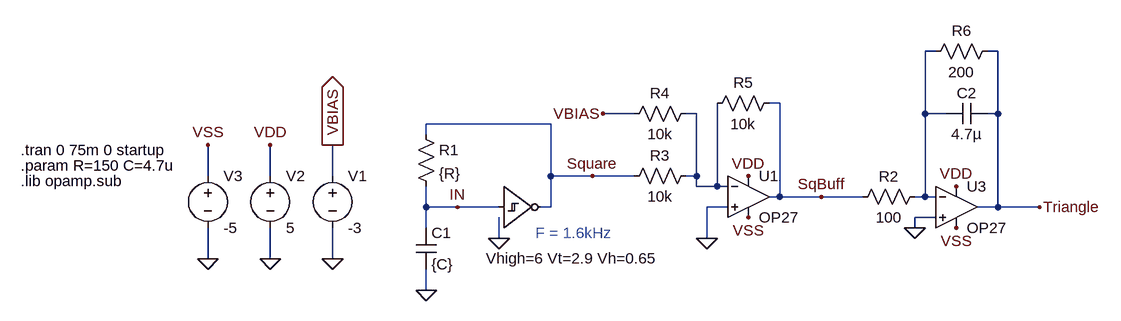
[diagram p0: schematic Schmitt_And_Integrator.asc]
Schmitt_And_Integrator.asc, the LTspice schematic file:
Version 4
SHEET 1 880 680
WIRE 480 -656 464 -656
WIRE 576 -656 560 -656
WIRE 240 -576 224 -576
WIRE 16 -560 -32 -560
WIRE 112 -560 96 -560
WIRE 464 -560 464 -656
WIRE 496 -560 464 -560
WIRE 576 -560 576 -656
WIRE 576 -560 560 -560
WIRE -112 -544 -304 -544
WIRE -304 -528 -304 -544
WIRE -640 -464 -640 -512
WIRE -544 -464 -544 -512
WIRE -448 -464 -448 -512
WIRE -112 -464 -112 -544
WIRE -48 -464 -112 -464
WIRE 16 -464 -48 -464
WIRE 112 -464 112 -560
WIRE 112 -464 96 -464
WIRE 112 -448 112 -464
WIRE 144 -448 144 -576
WIRE 144 -448 112 -448
WIRE 160 -448 144 -448
WIRE 240 -432 240 -576
WIRE 240 -432 224 -432
WIRE 304 -432 240 -432
WIRE 368 -432 304 -432
WIRE 464 -432 464 -560
WIRE 464 -432 448 -432
WIRE 480 -432 464 -432
WIRE -304 -416 -304 -448
WIRE -256 -416 -304 -416
WIRE -192 -416 -256 -416
WIRE -112 -416 -112 -464
WIRE -112 -416 -128 -416
WIRE 160 -416 128 -416
WIRE 576 -416 576 -560
WIRE 576 -416 544 -416
WIRE 640 -416 576 -416
WIRE 480 -400 448 -400
WIRE -304 -384 -304 -416
WIRE 448 -384 448 -400
WIRE -192 -368 -192 -400
WIRE 128 -368 128 -416
WIRE -640 -336 -640 -384
WIRE -544 -336 -544 -384
WIRE -448 -336 -448 -384
WIRE -304 -288 -304 -320
FLAG -192 -368 0
FLAG -304 -288 0
FLAG -256 -416 IN
FLAG 448 -384 0
FLAG 304 -432 SqBuff
FLAG 640 -416 Triangle
FLAG 128 -368 0
FLAG -448 -336 0
FLAG -448 -512 VBIAS
IOPIN -448 -512 Out
FLAG -32 -560 VBIAS
FLAG -544 -336 0
FLAG -640 -336 0
FLAG 512 -448 VDD
FLAG 512 -384 VSS
FLAG -48 -464 Square
FLAG 192 -464 VDD
FLAG 192 -400 VSS
FLAG -544 -512 VDD
FLAG -640 -512 VSS
SYMBOL res -320 -544 R0
SYMATTR InstName R1
SYMATTR Value {R}
SYMBOL cap -320 -384 R0
SYMATTR InstName C1
SYMATTR Value {C}
SYMBOL Digital\\schmtinv -192 -480 R0
WINDOW 0 8 32 Invisible 2
WINDOW 123 -20 143 Left 2
SYMATTR InstName A2
SYMATTR Value2 Vhigh=6 Vt=2.9 Vh=0.65
SYMATTR SpiceLine Td=12n
SYMBOL res 464 -448 R90
WINDOW 0 0 56 VBottom 2
WINDOW 3 32 56 VTop 2
SYMATTR InstName R2
SYMATTR Value 100
SYMBOL cap 560 -576 R90
WINDOW 0 0 32 VBottom 2
WINDOW 3 32 32 VTop 2
SYMATTR InstName C2
SYMATTR Value 4.7µ
SYMBOL res 112 -480 R90
WINDOW 0 0 56 VBottom 2
WINDOW 3 32 56 VTop 2
SYMATTR InstName R3
SYMATTR Value 10k
SYMBOL res 112 -576 R90
WINDOW 0 0 56 VBottom 2
WINDOW 3 32 56 VTop 2
SYMATTR InstName R4
SYMATTR Value 10k
SYMBOL res 240 -592 R90
WINDOW 0 0 56 VBottom 2
WINDOW 3 32 56 VTop 2
SYMATTR InstName R5
SYMATTR Value 10k
SYMBOL voltage -448 -480 R0
WINDOW 123 0 0 Left 2
WINDOW 39 0 0 Left 2
SYMATTR InstName V1
SYMATTR Value -3
SYMBOL Opamps\\OP27 512 -480 R0
SYMATTR InstName U3
SYMBOL voltage -544 -480 R0
SYMATTR InstName V2
SYMATTR Value 5
SYMBOL voltage -640 -480 R0
SYMATTR InstName V3
SYMATTR Value -5
SYMBOL res 576 -672 R90
WINDOW 0 0 56 VBottom 2
WINDOW 3 32 56 VTop 2
SYMATTR InstName R6
SYMATTR Value 200
SYMBOL Opamps\\OP27 192 -496 R0
SYMATTR InstName U1
TEXT -928 -456 Left 2 !.lib opamp.sub
TEXT -928 -504 Left 2 !.tran 0 75m 0 startup
TEXT -928 -480 Left 2 !.param R=150 C=4.7u
TEXT -136 -376 Left 2 ;F = 1.6kHz

The netlist it stands for:
* Schmitt_And_Integrator.asc
R1 Square IN {R}
C1 IN 0 {C}
A2 IN 0 0 0 0 Square 0 0 SCHMITT Vhigh=6 Vt=2.9 Vh=0.65 Td=12n
R2 N001 SqBuff 100
C2 Triangle N001 4.7µ
R3 N002 Square 10k
R4 N002 VBIAS 10k
R5 SqBuff N002 10k
V1 VBIAS 0 -3
XU3 0 N001 VDD VSS Triangle OP27  ; pins In+ In- V+ V- OUT
V2 VDD 0 5
V3 VSS 0 -5
R6 Triangle N001 200
XU1 0 N002 VDD VSS SqBuff OP27  ; pins In+ In- V+ V- OUT
.lib opamp.sub
.tran 0 75m 0 startup
.param R=150 C=4.7u
* F = 1.6kHz
.lib ADI.lib
.backanno
.end